# Altium schematic sheet W5500.SchDoc
size A4
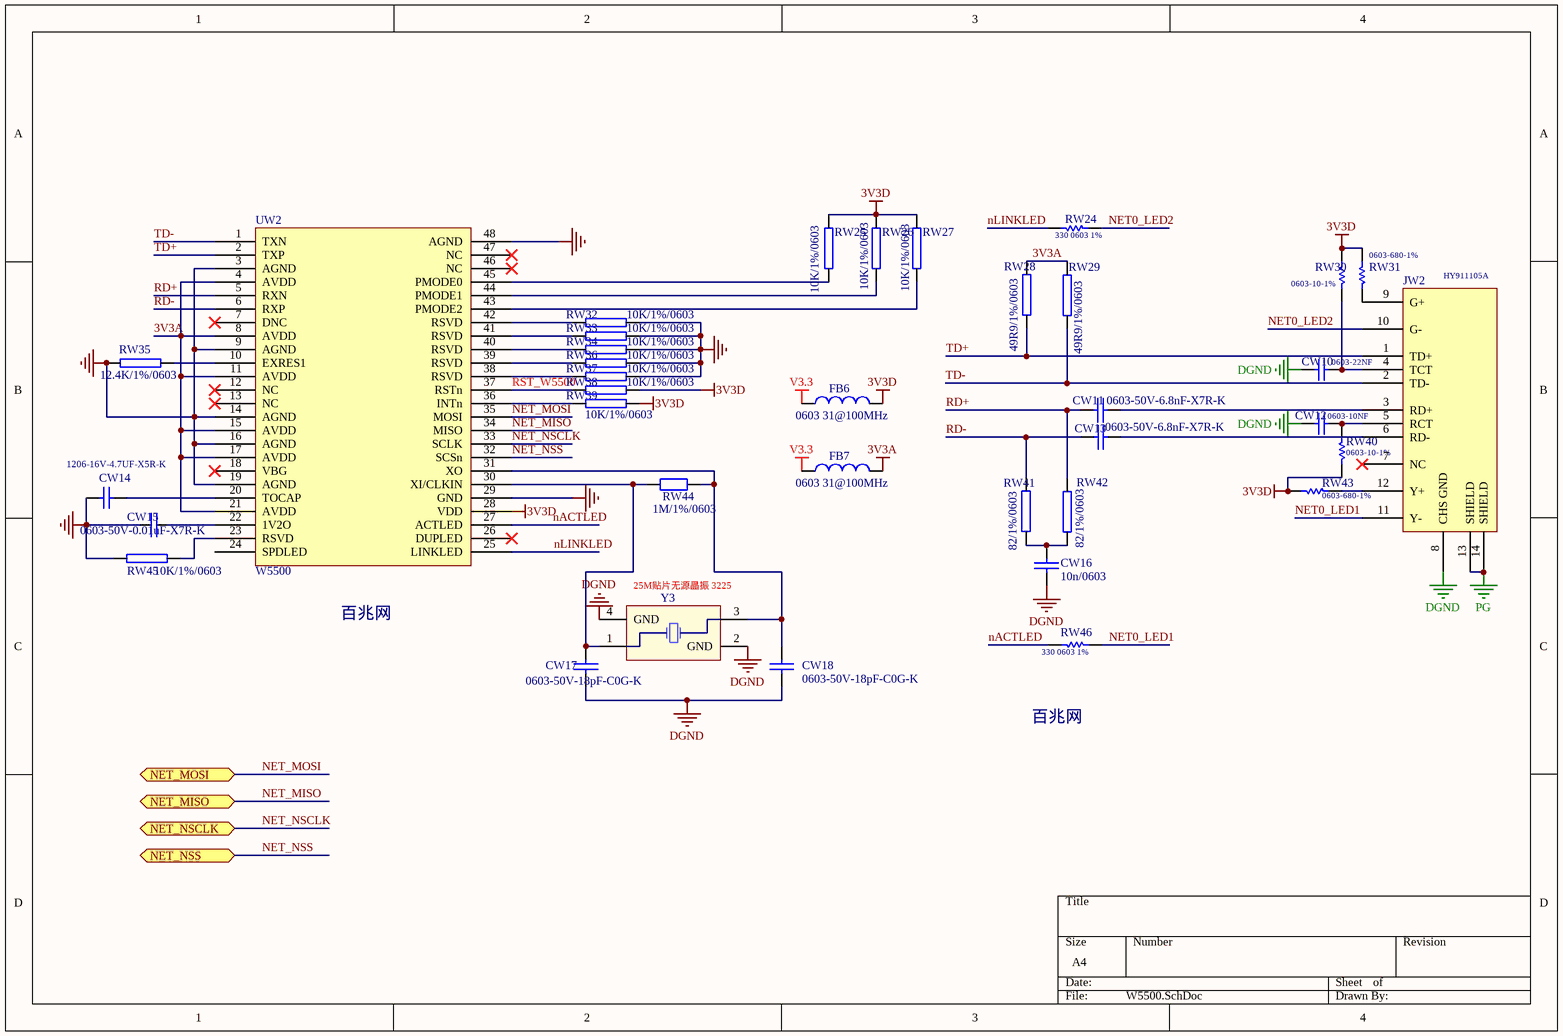
[diagram p0: W5500.SchDoc]

## Parts
CW10  0603-22NF  [0603C]
CW11  0603-50V-6.8nF-X7R-K  [0603C]
CW12  0603-10NF  [0603C]
CW13  0603-50V-6.8nF-X7R-K  [0603C]
CW14  1206-16V-4.7UF-X5R-K  [1206C]
CW15  0603-50V-0.01uF-X7R-K  [0603C]
CW16  10n/0603  [0603C]
CW17  0603-50V-18pF-C0G-K  [0603C]
CW18  0603-50V-18pF-C0G-K  [0603C]
FB6  0603 31@100MHz  [0603L]
FB7  0603 31@100MHz  [0603L]
JW2  HY911105A  [HY911105A]
RW24  330 0603 1%  [0603R]
RW25  10K/1%/0603  [0603R]
RW26  10K/1%/0603  [0603R]
RW27  10K/1%/0603  [0603R]
RW28  49R9/1%/0603  [0603R]
RW29  49R9/1%/0603  [0603R]
RW30  0603-10-1%  [0603R]
RW31  0603-680-1%  [0603R]
RW32  10K/1%/0603  [0603R]
RW33  10K/1%/0603  [0603R]
RW34  10K/1%/0603  [0603R]
RW35  12.4K/1%/0603  [0603R]
RW36  10K/1%/0603  [0603R]
RW37  10K/1%/0603  [0603R]
RW38  10K/1%/0603  [0603R]
RW39  10K/1%/0603  [0603R]
RW40  0603-10-1%  [0603R]
RW41  82/1%/0603  [0603R]
RW42  82/1%/0603  [0603R]
RW43  0603-680-1%  [0603R]
RW44  1M/1%/0603  [0603R]
RW45  10K/1%/0603  [0603R]
RW46  330 0603 1%  [0603R]
UW2  W5500  [LQFP-48]
Y3  25M贴片无源晶振 3225  [OSC3225_4P]

## Ports
NET_MISO (bidir), NET_MOSI (bidir), NET_NSCLK (bidir), NET_NSS (bidir)

## Nets
3V3A: FB7.2 RW28.2 RW29.2 UW2.4(AVDD) UW2.8(AVDD) UW2.11(AVDD) UW2.15(AVDD) UW2.17(AVDD) UW2.21(AVDD)
3V3D: FB6.2 RW25.2 RW26.2 RW27.2 RW30.1 RW31.1 RW38.2 RW39.2 RW40.1 RW43.1 UW2.28(VDD)
DGND: CW10.2 CW12.2 CW14.2 CW15.2 CW16.2 CW17.1 CW18.1 JW2.8(CHS_GND) RW32.1 RW33.1 RW34.1 RW35.2 RW36.1 RW37.1 RW45.2 UW2.3(AGND) UW2.9(AGND) UW2.14(AGND) UW2.16(AGND) UW2.19(AGND) UW2.29(GND) UW2.48(AGND) Y3.2(GND) Y3.4(GND)
PG: JW2.13(SHIELD) JW2.14(SHIELD)
V3.3: FB6.1 FB7.1
nACTLED: RW46.2 UW2.27(ACTLED)
NET0_LED1: JW2.11(Y-) RW46.1
NET0_LED2: JW2.10(G-) RW24.1
NET_MISO: UW2.34(MISO) ; port NET_MISO
NET_MOSI: UW2.35(MOSI) ; port NET_MOSI
NET_NSCLK: UW2.33(SCLK) ; port NET_NSCLK
NET_NSS: UW2.32(SCSn) ; port NET_NSS
nLINKLED: RW24.2 UW2.25(LINKLED)
RD+: CW11.2 RW42.2 UW2.5(RXN)
RD-: CW13.2 RW41.2 UW2.6(RXP)
RST_W5500: RW38.1 UW2.37(RSTn)
TD+: JW2.1(TD+) RW28.1 UW2.2(TXP)
TD-: JW2.2(TD-) RW29.1 UW2.1(TXN)
NetCW10_1: CW10.1 JW2.4(TCT) RW30.2
NetCW11_1: CW11.1 JW2.3(RD+)
NetCW12_1: CW12.1 JW2.5(RCT) RW40.2
NetCW13_1: CW13.1 JW2.6(RD-)
NetCW14_1: CW14.1 UW2.20(TOCAP)
NetCW15_1: CW15.1 UW2.22(1V2O)
NetCW16_1: CW16.1 RW41.1 RW42.1
NetCW17_2: CW17.2 RW44.2 UW2.30(XI/CLKIN) Y3.1(OSC1)
NetCW18_2: CW18.2 RW44.1 UW2.31(XO) Y3.3
NetJW2_9: JW2.9(G+) RW31.2
NetJW2_12: JW2.12(Y+) RW43.2
NetRW25_1: RW25.1 UW2.45(PMODE0)
NetRW26_1: RW26.1 UW2.44(PMODE1)
NetRW27_1: RW27.1 UW2.43(PMODE2)
NetRW32_2: RW32.2 UW2.42(RSVD)
NetRW33_2: RW33.2 UW2.41(RSVD)
NetRW34_2: RW34.2 UW2.40(RSVD)
NetRW35_1: RW35.1 UW2.10(EXRES1)
NetRW36_2: RW36.2 UW2.39(RSVD)
NetRW37_2: RW37.2 UW2.38(RSVD)
NetRW39_1: RW39.1 UW2.36(INTn)
NetRW45_1: RW45.1 UW2.23(RSVD)

Not connected (* = marked no-connect by the designer): JW2 7(NC)*; UW2 7(DNC)* 12(NC)* 13(NC)* 18(VBG)* 24(SPDLED) 26(DUPLED)* 46(NC)* 47(NC)*

## Notes on the sheet
- (near UW2) 百兆网
- 百兆网

## Library data of the parts
CW10 CW12 = Cap: Capacitor; Value: 0603B103J500NT; Published: 8-Jun-2000; LatestRevisionDate: 17-Jul-2002; LatestRevisionNote: Re-released for DXP Platform.; PackageReference: RAD-0.3; Publisher: Altium Limited
CW11 CW13 CW16-CW18 = CAP: Capacitor; Value: 39pF
CW14 = Cap: 贴片电容; Value: 0.1u; Published: 8-Jun-2000; LatestRevisionDate: 17-Jul-2002; LatestRevisionNote: Re-released for DXP Platform.; PackageReference: RAD-0.3; Publisher: Altium Limited; PackageDescription: Radial Cap, Thru-Hole; 2 Leads; 0.3 in Pin Spacing
CW15 = CAP: Capacitor
FB6 FB7 = Inductor: Code_IEC: 1005; Value: 31Ω; Published: 8-Jun-2000; LatestRevisionDate: 29-May-2009; LatestRevisionNote: IPC-7351 Footprint Added.; PackageReference: 0402-A; Publisher: Altium Limited; PackageDescription: Chip Inductor; Code_JEITA: 0402
RW24 RW30 RW31 RW40 RW43 RW46 = Res1: Resistor; Value: 1K; Published: 8-Jun-2000; LatestRevisionDate: 17-Jul-2002; LatestRevisionNote: Re-released for DXP Platform.; PackageReference: AXIAL-0.3; Publisher: Altium Limited
RW25-RW29 RW32-RW39 RW41 RW42 RW45 = RES1
RW44 = Res2: Resistor; Published: 8-Jun-2000; LatestRevisionDate: 17-Jul-2002; LatestRevisionNote: Re-released for DXP Platform.; Publisher: Altium Limited; Value: 1M/1%/0603
Y3 = OSC5032: Crystal Oscillator; Published: 8-Jun-2000; LatestRevisionDate: 17-Jul-2002; LatestRevisionNote: Re-released for DXP Platform.; PackageReference: R38; Publisher: Altium Limited; PackageDescription: Crystal, Thru-Hole; 2 Leads; Body 3.1 x 8.2 mm (Dia.xH)
UW2 = W5500: Value: W5500